# EAGLE design main (EAGLE 8.3.1)
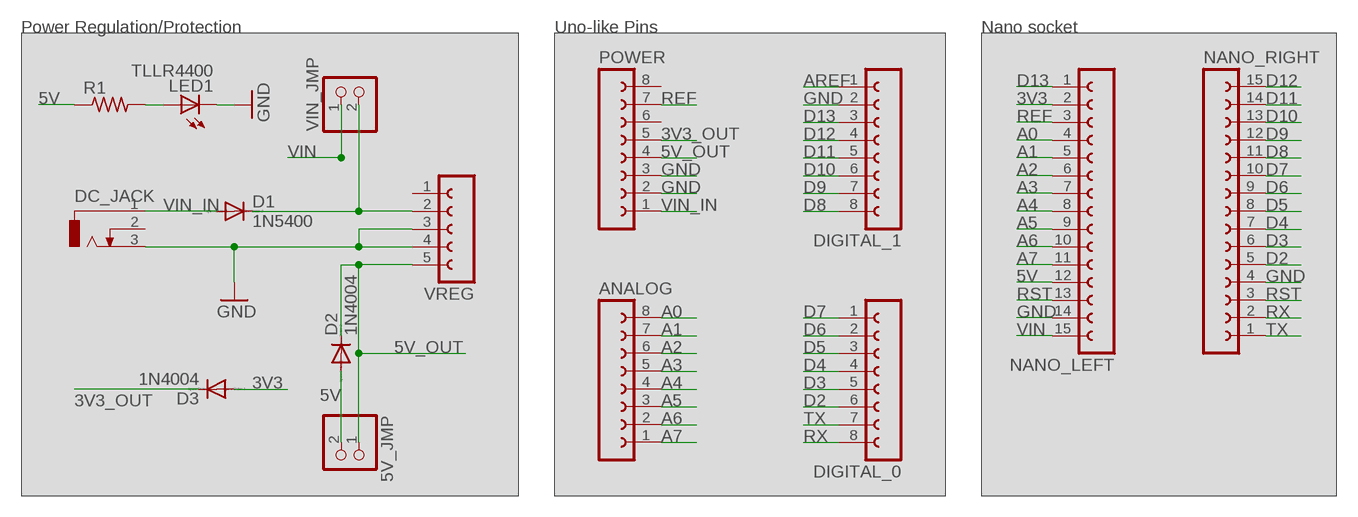
[diagram p0: schematic, sheet 1]

## Parts
5V_JMP  PINHD-1X2  [1X02]
ANALOG  FE08-1  [FE08]
D1  1N5400  [DO201-15]
D2  1N4004  [DO41-10]
D3  1N4004  [DO41-10]
DC_JACK  DCJ0303  [DCJ0303]
DIGITAL_0  FE08-1  [FE08]
DIGITAL_1  FE08-1  [FE08]
LED1  TLLR4400  [LED3MM]
NANO_LEFT  FE15-1  [FE15]
NANO_RIGHT  FE15-1  [FE15]
POWER  FE08-1  [FE08]
R1  R-US_0207/10  [0207/10]
VIN_JMP  PINHD-1X2  [1X02]
VREG  FE05-1  [FE05-1]

## Nets
3V3: D3.A NANO_LEFT.2
3V3_OUT: D3.C POWER.5
5V: 5V_JMP.2 D2.A NANO_LEFT.12 R1.1
5V_OUT: 5V_JMP.1 D2.C POWER.4 VREG.5
A0: ANALOG.8 NANO_LEFT.4
A1: ANALOG.7 NANO_LEFT.5
A2: ANALOG.6 NANO_LEFT.6
A3: ANALOG.5 NANO_LEFT.7
A4: ANALOG.4 NANO_LEFT.8
A5: ANALOG.3 NANO_LEFT.9
A6: ANALOG.2 NANO_LEFT.10
A7: ANALOG.1 NANO_LEFT.11
AREF: DIGITAL_1.1
D2: DIGITAL_0.6 NANO_RIGHT.5
D3: DIGITAL_0.5 NANO_RIGHT.6
D4: DIGITAL_0.4 NANO_RIGHT.7
D5: DIGITAL_0.3 NANO_RIGHT.8
D6: DIGITAL_0.2 NANO_RIGHT.9
D7: DIGITAL_0.1 NANO_RIGHT.10
D8: DIGITAL_1.8 NANO_RIGHT.11
D9: DIGITAL_1.7 NANO_RIGHT.12
D10: DIGITAL_1.6 NANO_RIGHT.13
D11: DIGITAL_1.5 NANO_RIGHT.14
D12: DIGITAL_1.4 NANO_RIGHT.15
D13: DIGITAL_1.3 NANO_LEFT.1
GND: DC_JACK.3 DIGITAL_1.2 LED1.K(C) NANO_LEFT.14 NANO_RIGHT.4 POWER.2 POWER.3 VREG.3 VREG.4
N$1: LED1.A R1.2
N$2: D1.C VIN_JMP.2 VREG.2
REF: NANO_LEFT.3 POWER.7
RST: NANO_LEFT.13 NANO_RIGHT.3
RX: DIGITAL_0.8 NANO_RIGHT.2
TX: DIGITAL_0.7 NANO_RIGHT.1
VIN: NANO_LEFT.15 VIN_JMP.1
VIN_IN: D1.A DC_JACK.1 POWER.1
Unconnected: DC_JACK.2 POWER.6 POWER.8 VREG.1

## Notes on the sheet
- Power Regulation/Protection | Uno-like Pins | Nano socket

## Library data of the parts
5V_JMP VIN_JMP = pinhead:PINHD-1X2: PIN HEADER
ANALOG DIGITAL_0 DIGITAL_1 POWER = con-lsta:FE08-1: FEMALE HEADER; OC_FARNELL: unknown; OC_NEWARK: unknown
D1 = diode:1N5400: DIODE standard rectifier, 3 A, 50 V (Motorola)
D2 D3 = diode:1N4004: DIODE general purpose rectifier, 1 A
DC_JACK = con-jack:DCJ0303: DC POWER JACK Source: DCJ0303.pdf; OC_FARNELL: unknown; OC_NEWARK: unknown
LED1 = led:TLLR4400: Low Current (2mA) LED 3 mm Tinted Diffused Package color RED Source: Data sheet <http://www.farnell.com/datasheets/391100.pdf>; MF: VISHAY SEMICONDUCTOR; OC_FARNELL: 1612437
NANO_LEFT NANO_RIGHT = con-lsta:FE15-1: FEMALE HEADER; OC_FARNELL: unknown; OC_NEWARK: unknown
R1 = rcl:R-US_: RESISTOR, American symbol
VREG = con-lsta:FE05-1: FEMALE HEADER; OC_FARNELL: unknown; OC_NEWARK: unknown

## Board
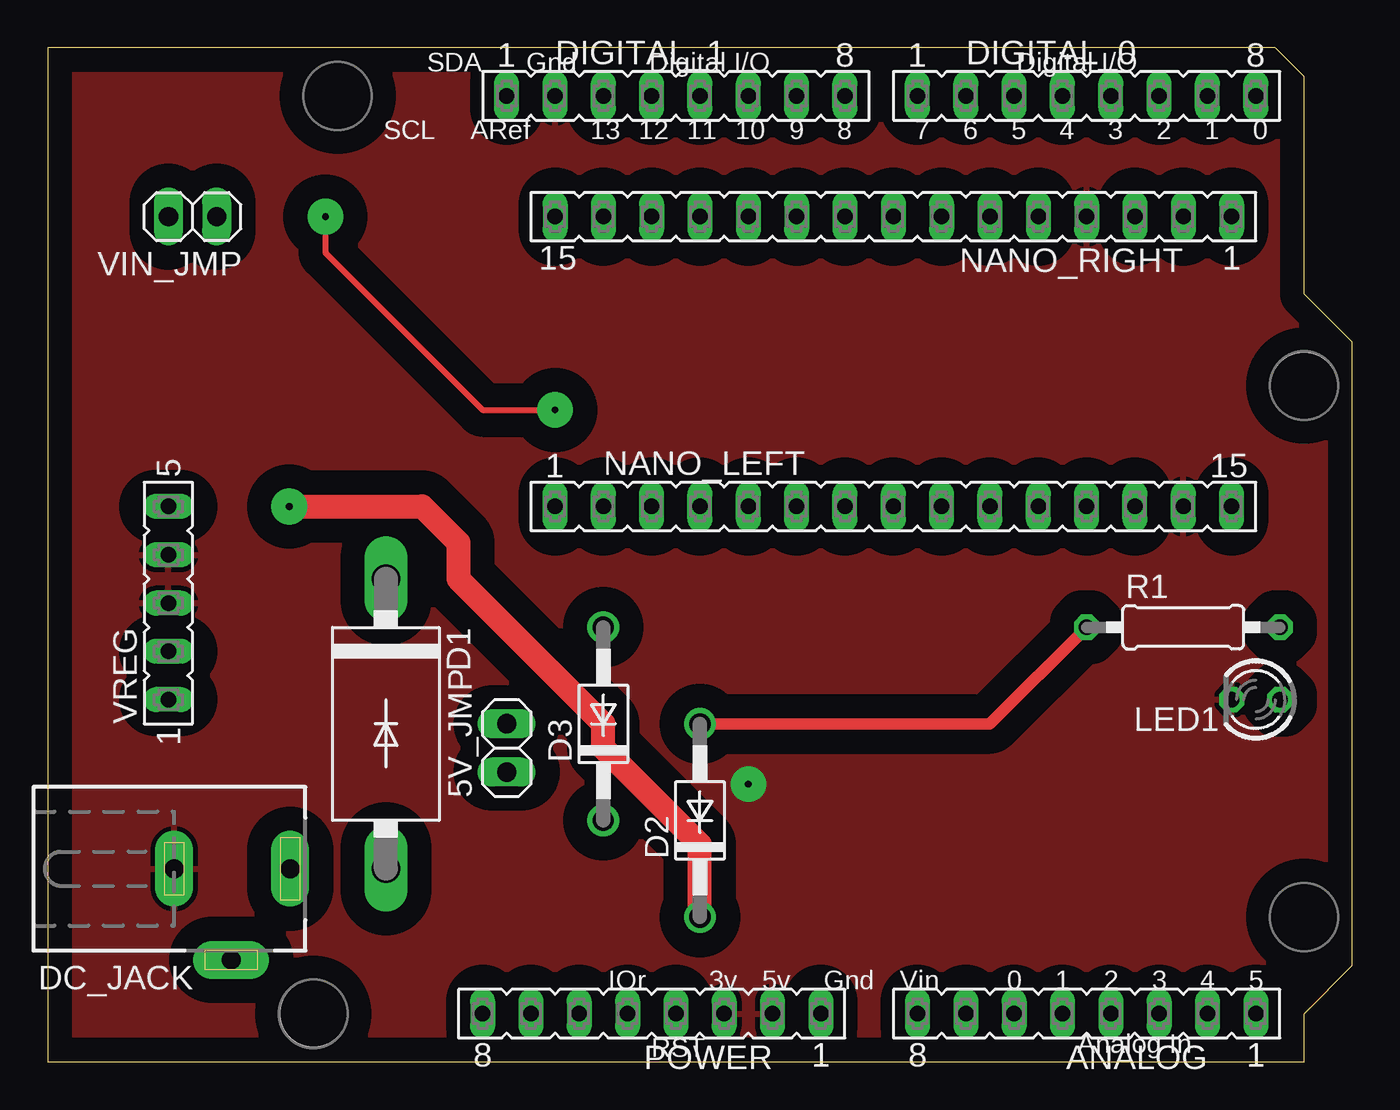
[diagram p1: board, top side]
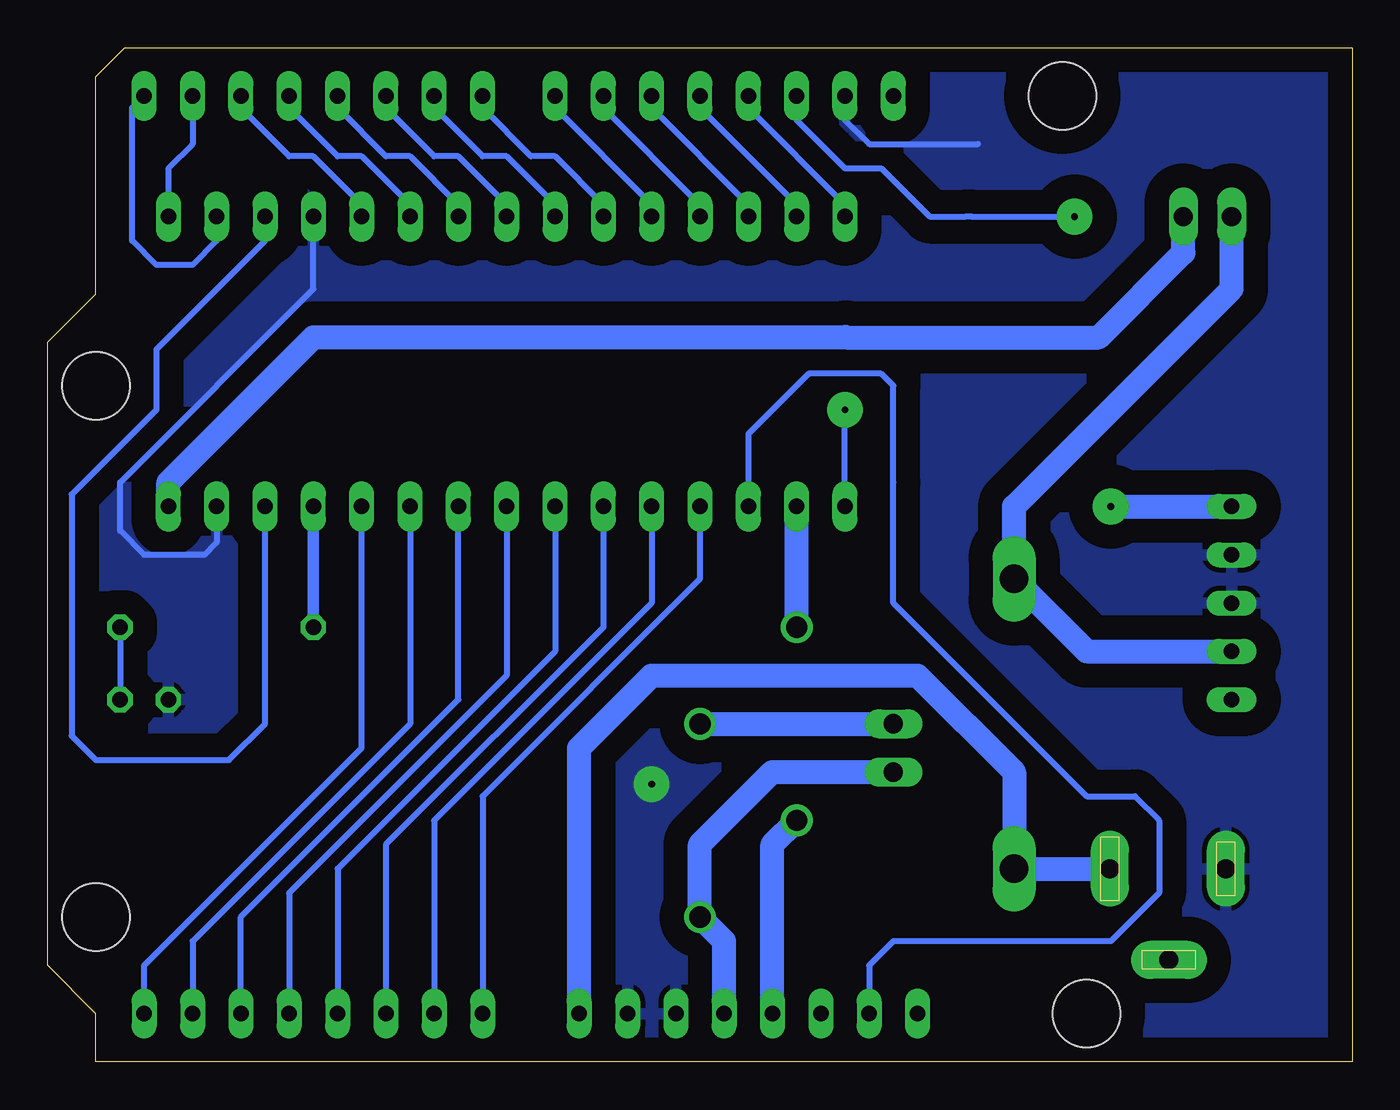
[diagram p2: board, bottom side, seen from below]

Size 68.58 x 53.34 mm. Coordinates in mm from the lower left corner, seen from the top.
Outline: 0,0 66.04,0 66.04,2.54 68.58,5.08 68.58,37.85 66.04,40.39 66.04,51.82 64.52,53.34 0,53.34 0,0
Copper layers (1*16): Top 0.035mm / dielectric 1.5mm / Bottom 0.035mm
Design rules "default *": minimum track width 24mil, minimum drill 0.5mm, track to track 12mil, track to pad 24mil, pad to pad 24mil, via to via 24mil, smd to smd 24mil, copper to edge 40mil, drill to drill 6mil, minimum pad ring 10mil, minimum via ring 30mil, stop-mask expansion 4mil, vias tented up to drill 0mil, thermal gap 10mil
Holes 3.56 mm at 13.97,2.54 66.04,7.62 66.04,35.56 15.24,50.8

### Footprints (pad centres in the part's own frame; a part is rotated, then mirrored left to right if it is on the bottom)
1X02 = drill 1.016 long: 1 -1.27,0; 2 1.27,0
FE08 = drill 0.813 long: 1 -8.89,0; 2 -6.35,0; 3 -3.81,0; 4 -1.27,0; 5 1.27,0; 6 3.81,0; 7 6.35,0; 8 8.89,0
DO201-15 = drill 1.499 long: A 7.62,0; C -7.62,0
DO41-10 = drill 1.118: A 5.08,0; C -5.08,0
DCJ0303 = drill 1 pad 2 long: 1 0,3.1; 2 4.8,0; 3 0,-3
LED3MM = drill 0.813 octagon: A -1.27,0; K 1.27,0
FE15 = drill 0.813 long: 1 -17.78,0; 2 -15.24,0; 3 -12.7,0; 4 -10.16,0; 5 -7.62,0; 6 -5.08,0; 7 -2.54,0; 8 0,0; 9 2.54,0; 10 5.08,0; 11 7.62,0; 12 10.16,0; 13 12.7,0; 14 15.24,0; 15 17.78,0
0207/10 = drill 0.813 octagon: 1 -5.08,0; 2 5.08,0
FE05-1 = drill 0.813 long: 1 -5.08,0; 2 -2.54,0; 3 0,0; 4 2.54,0; 5 5.08,0

### Placement (x,y rotation side)
5V_JMP  24.13,16.51 90 top
ANALOG  54.61,2.54 180 top
D1  17.78,17.78 270 top
D2  34.29,12.7 90 top
D3  29.21,17.78 90 top
DC_JACK  9.65,10.16 270 top
DIGITAL_0  54.61,50.8 0 top
DIGITAL_1  33.02,50.8 0 top
LED1  63.5,19.05 180 top
NANO_LEFT  44.45,29.21 0 top
NANO_RIGHT  44.45,44.45 180 top
POWER  31.75,2.54 180 top
R1  59.69,22.86 0 top
VIN_JMP  7.62,44.45 180 top
VREG  6.35,24.13 90 top

### Tracks (layer width: path | path; a pad name or v marks a point on that pad's centre or on a via)
3V3
  Bottom 1.27: D3.A NANO_LEFT.2
3V3_OUT
  Bottom 1.27: POWER.5 30.48,11.43 D3.C
5V
  Top 0.61: D2.A 49.53,17.78 R1.1
  Bottom 0.61: NANO_LEFT.12 R1.1
  Bottom 1.27: D2.A 5V_JMP.2
5V_OUT  (via drill 0.35)
  Top 1.27: D2.C 34.29,11.43 29.21,16.51 29.21,17.78 21.59,25.4 21.59,27.3 19.69,29.21 v12.7,29.21
  Bottom 1.27: POWER.4 33.02,6.35 D2.C 34.29,11.43 30.48,15.24 5V_JMP.1 | v12.7,29.21 VREG.5
A0
  Bottom 0.305: NANO_LEFT.4 34.29,25.4 45.72,13.97 ANALOG.8
A1
  Bottom 0.305: NANO_LEFT.5 36.83,24.13 48.26,12.7 ANALOG.7
A2
  Bottom 0.305: NANO_LEFT.6 39.37,22.86 50.8,11.43 ANALOG.6
A3
  Bottom 0.305: NANO_LEFT.7 41.91,21.59 53.34,10.16 ANALOG.5
A4
  Bottom 0.305: NANO_LEFT.8 44.45,20.32 55.88,8.89 ANALOG.4
A5
  Bottom 0.305: ANALOG.3 58.42,7.62 46.99,19.05 NANO_LEFT.9
A6
  Bottom 0.305: NANO_LEFT.10 49.53,17.78 60.96,6.35 ANALOG.2
A7
  Bottom 0.305: ANALOG.1 63.5,5.08 52.07,16.51 NANO_LEFT.11
D2
  Bottom 0.305: NANO_RIGHT.5 52.07,45.09 54.61,47.62 55.88,47.62 58.42,50.16 DIGITAL_0.6
D3
  Bottom 0.305: NANO_RIGHT.6 49.53,45.09 52.07,47.62 53.34,47.62 55.88,50.16 DIGITAL_0.5
D4
  Bottom 0.305: NANO_RIGHT.7 46.99,45.09 49.53,47.62 50.8,47.62 53.34,50.16 DIGITAL_0.4
D5
  Bottom 0.305: NANO_RIGHT.8 44.45,45.09 46.99,47.62 48.26,47.62 50.8,50.16 DIGITAL_0.3
D6
  Bottom 0.305: NANO_RIGHT.9 41.91,45.09 44.45,47.62 45.72,47.62 48.26,50.16 DIGITAL_0.2
D7
  Bottom 0.305: 39.37,45.09 NANO_RIGHT.10 39.37,45.09 | 39.37,45.09 41.91,47.62 43.18,47.62 45.72,50.16 DIGITAL_0.1
D8
  Bottom 0.305: NANO_RIGHT.11 36.83,45.09 41.91,50.16 DIGITAL_1.8
D9
  Bottom 0.305: 39.36,50.79 DIGITAL_1.7 39.37,50.16 34.29,45.09 NANO_RIGHT.12
D10
  Bottom 0.305: NANO_RIGHT.13 31.75,45.09 36.83,50.16 DIGITAL_1.6
D11
  Bottom 0.305: NANO_RIGHT.14 29.21,45.09 34.29,50.16 DIGITAL_1.5
D12
  Bottom 0.305: NANO_RIGHT.15 26.67,45.09 31.75,50.16 DIGITAL_1.4
D13  (via drill 0.35)
  Top 0.305: v14.6,44.45 14.6,42.54 22.86,34.29 v26.67,34.29
  Bottom 0.305: 29.21,50.16 DIGITAL_1.3 29.21,49.53 26.67,46.99 24.77,46.99 22.23,44.45 20.32,44.45 20.02,44.45 v14.6,44.45 | NANO_LEFT.1 v26.67,34.29
GND  (via drill 0.35)
  Bottom 0.305: DIGITAL_1.2 26.67,49.53 25.4,48.26 19.69,48.26 | NANO_LEFT.14 59.69,27.3 60.33,26.67 63.5,26.67 64.77,27.94 64.77,30.48 54.61,40.64 NANO_RIGHT.4
  other vias: 36.83,14.6
  pour Bottom (isolate 1.27): 0,53.34 0,0 66.04,0 66.04,2.54 68.58,5.08 68.58,38.1 66.04,40.64 66.04,52.07 64.77,53.34
  pour Top (isolate 1.27): 0,53.34 0,0 66.04,0 66.04,1.9 66.04,2.54 68.58,5.08 68.58,38.1 66.04,40.64 66.04,52.07 64.77,53.34
N$1
  Bottom 0.305: R1.2 LED1.A
N$2
  Bottom 1.27: VREG.2 13.97,21.59 D1.C 17.78,29.21 6.35,40.64 VIN_JMP.2
REF
  Bottom 0.305: POWER.7 25.4,5.08 24.13,6.35 12.7,6.35 10.16,8.89 10.16,12.7 11.43,13.97 13.97,13.97 24.13,24.13 24.13,30.48 24.13,35.56 24.77,36.2 28.57,36.2 31.75,33.02 NANO_LEFT.3
RST
  Bottom 0.305: NANO_RIGHT.3 57.15,43.18 62.86,37.46 62.86,34.29 67.31,29.84 67.31,17.14 66.04,15.87 59.05,15.87 57.15,17.78 NANO_LEFT.13
RX
  Bottom 0.305: NANO_RIGHT.2 59.69,43.18 60.96,41.91 62.86,41.91 64.14,43.18 64.14,50.16 DIGITAL_0.8
TX
  Bottom 0.305: DIGITAL_0.7 60.96,48.26 62.23,46.99 NANO_RIGHT.1
VIN
  Bottom 1.27: NANO_LEFT.15 62.23,30.48 54.61,38.1 26.67,38.1 26.64,38.13 | 26.64,38.1 26.64,38.13 | 26.64,38.13 26.6,38.1 13.33,38.1 8.89,42.54 VIN_JMP.1
VIN_IN
  Bottom 1.27: POWER.1 40.64,16.51 36.83,20.32 22.86,20.32 17.78,15.24 D1.A DC_JACK.1

### Text on the board
tPlace: SDA | Gnd | Digital I/O | Digital I/O | 13 | 12 | 11 | 10 | 9 | 8 | 7 | 6 | 5 | 4 | 3 | 2 | 1 | 0 | SCL | ARef | IOr | 3v | 5v | Gnd | Vin | 0 | 1 | 2 | 3 | 4 | 5 | Analog In | RST